# EasyEDA schematic Scheduler_2021-07-28_12-27-31.json
TITLE: Sheet_1; REV: 1.0; Date: 2021-07-27; Sheet: 1/1; Company: Muqing Shen
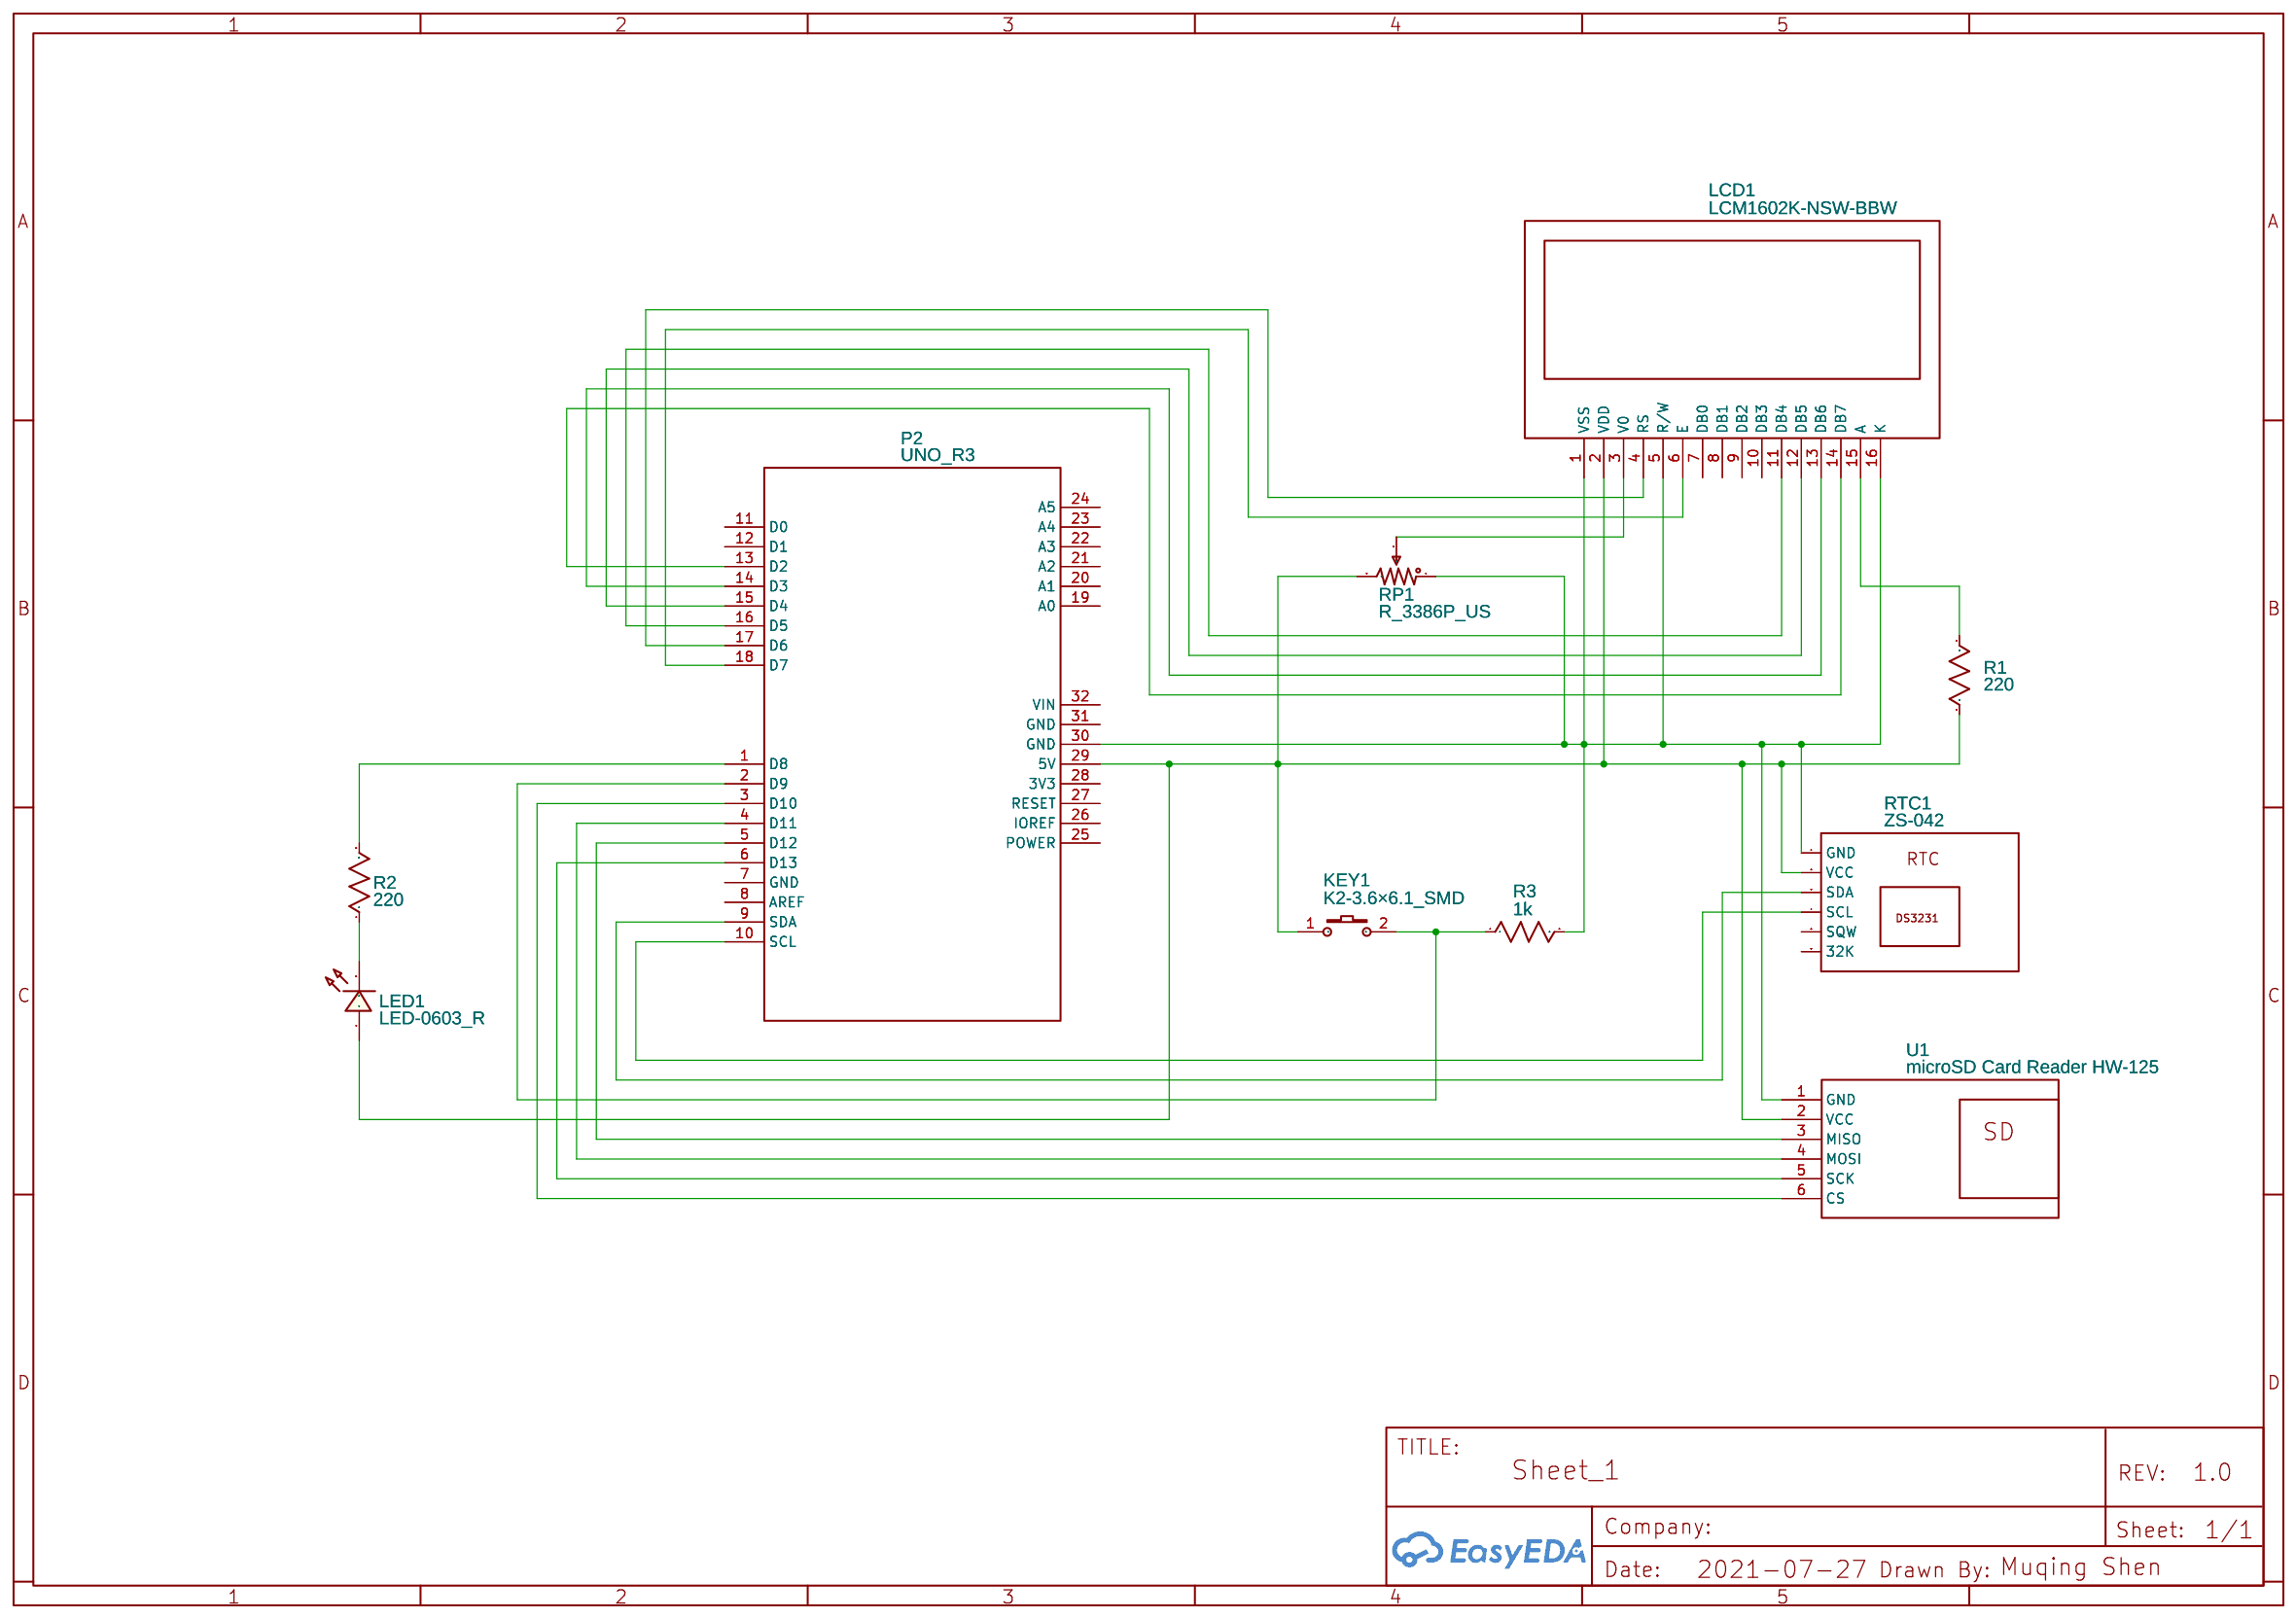
[diagram p0: schematic sheet]

## Parts
KEY1  K2-3.6×6.1_SMD  [KEY-SMD_2P-L6.2-W3.6-LS8.0]
LCD1  LCM1602K-NSW-BBW  [MODULE-TH_LCM1602K]
LED1  LED-0603_R  [LED0603_RED]
P2  UNO_R3  [UNO_R3]
R1  220  [R0603]
R2  220  [R0603]
R3  1k  [R0603]
RP1  R_3386P_US  [RES-ADJ-TH_3386P]
RTC1  ZS-042  [ZS-042]
U1  microSD Card Reader HW-125  [MICROSD CARD READER HW-125]

## Library data of the parts
KEY1 = K2-3.6×6.1_SMD: Supplier Part: C118141; Supplier: LCSC; Manufacturer Part: K2-1107ST-A4SW-06; Contributor: LCEDA_Lib; 制造商: 韩国韩荣
LCD1 = LCM1602K-NSW-BBW: Supplier: LCSC; Manufacturer: LONTECH; Supplier Part: C83275; JLCPCB Part Class: Extended Part
LED1 = LED-0603_R: Manufacturer: EVERLIGHT(台湾亿光); Manufacturer Part: 19-217/R6C-AL1M2VY/3T; Supplier Part: C72044; Supplier: LCSC; Contributor: LCEDA_01
P2 = UNO_R3: sourceId: 1T5FDZYC8
R1-R3 = R_0603_US: Contributor: LCEDA_Lib
RP1 = R_3386P_US: Supplier: LCSC; Contributor: LCEDA_Lib; value(Ω): 10K
RTC1 = ZS-042: Contributor: zaven.azatyan
U1 = microSD Card Reader HW-125: Contributor: allvex

## Nets
Net-(KEY1-1): KEY1.1 LCD1.2(VDD) LED1.1 P2.29(5V) R1.1 RP1.3 RTC1.2(VCC) U1.2(VCC)
Net-(KEY1-2): KEY1.2 P2.2(D9) R3.1
Net-(LCD1-1): LCD1.1(VSS) LCD1.5(R/W) LCD1.16(K) P2.30(GND) R3.2 RP1.1 RTC1.1(GND) U1.1(GND)
Net-(LCD1-3): LCD1.3(V0) RP1.2
Net-(LCD1-4): LCD1.4(RS) P2.17(D6)
Net-(LCD1-6): LCD1.6(E) P2.18(D7)
Net-(LCD1-11): LCD1.11(DB4) P2.16(D5)
Net-(LCD1-12): LCD1.12(DB5) P2.15(D4)
Net-(LCD1-13): LCD1.13(DB6) P2.14(D3)
Net-(LCD1-14): LCD1.14(DB7) P2.13(D2)
Net-(LCD1-15): LCD1.15(A) R1.2
Net-(LED1-2): LED1.2 R2.1
Net-(P2-1): P2.1(D8) R2.2
Net-(P2-3): P2.3(D10) U1.6(CS)
Net-(P2-4): P2.4(D11) U1.4(MOSI)
Net-(P2-5): P2.5(D12) U1.3(MISO)
Net-(P2-6): P2.6(D13) U1.5(SCK)
Net-(P2-9): P2.9(SDA) RTC1.3(SDA)
Net-(P2-10): P2.10(SCL) RTC1.4(SCL)

Not connected (* = marked no-connect by the designer): LCD1 7(DB0) 8(DB1) 9(DB2) 10(DB3); P2 7(GND) 8(AREF) 11(D0) 12(D1) 19(A0) 20(A1) 21(A2) 22(A3) 23(A4) 24(A5) 25(POWER) 26(IOREF) 27(RESET) 28(3V3) 31(GND) 32(VIN); RTC1 5(SQW) 6(32K)
